# EAGLE schematic node_v2 (EAGLE 7.2.0)
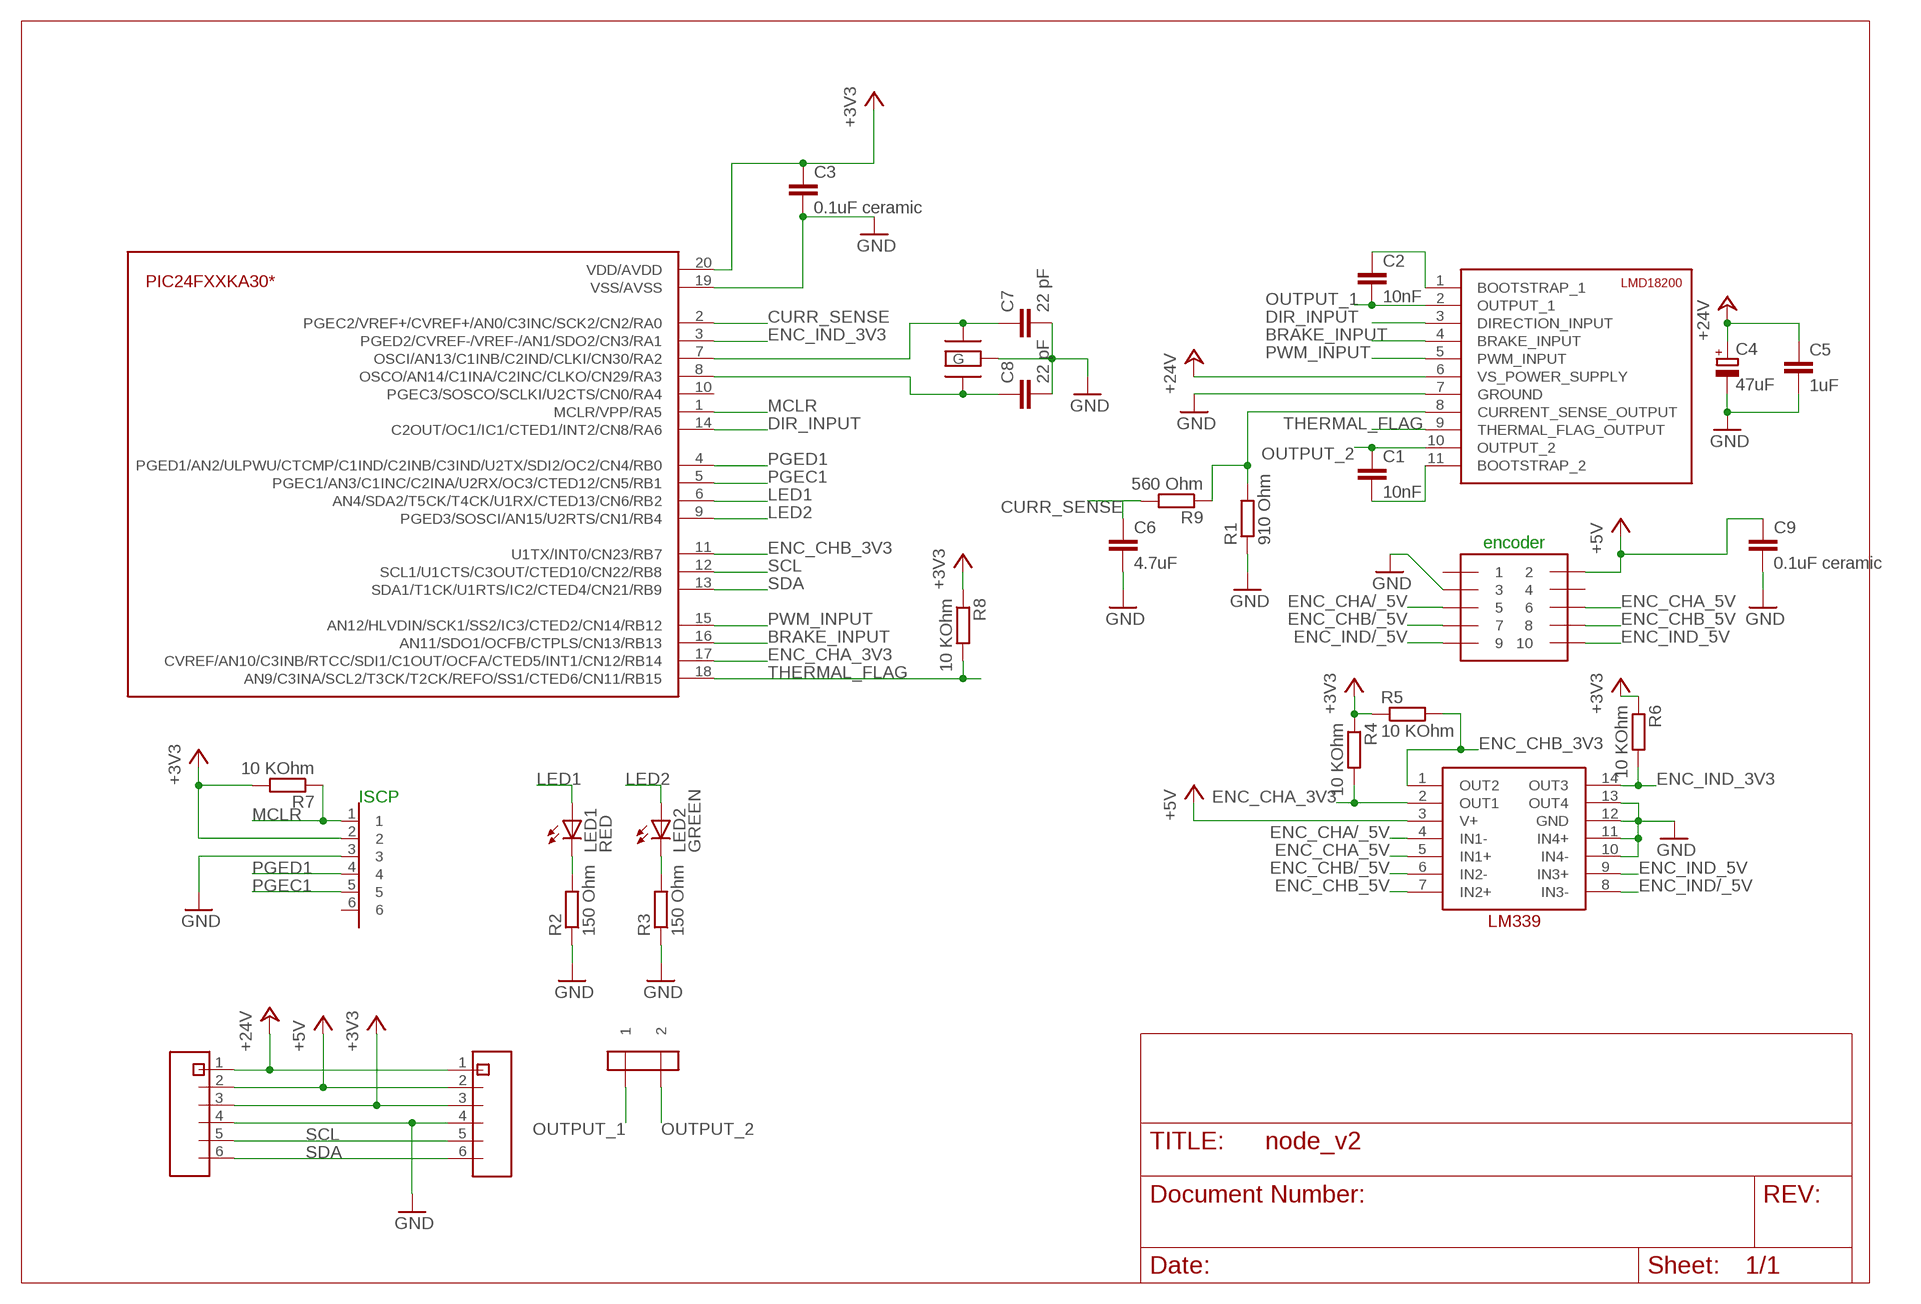
[diagram p0: schematic, sheet 1]

## Parts
C1  10nF  C-EUC0603  [C0603]
C2  10nF  C-EUC0603  [C0603]
C3  0.1uF ceramic  C-EUC0805K  [C0805K]
C4  47uF  CPOL-EUE5-10.5  [E5-10,5]
C5  1uF  C-EU050-025X075  [C050-025X075]
C6  4.7uF  C-EUC0805K  [C0805K]
C7  22 pF  C-EUC0603  [C0603]
C8  22 pF  C-EUC0603  [C0603]
C9  0.1uF ceramic  C-EUC0805K  [C0805K]
LED1  RED  LEDCHIPLED_1206  [CHIPLED_1206]
LED2  GREEN  LEDCHIPLED_1206  [CHIPLED_1206]
R1  910 Ohm  R-EU_R0603  [R0603]
R2  150 Ohm  R-EU_R0603  [R0603]
R3  150 Ohm  R-EU_R0603  [R0603]
R4  10 KOhm  R-EU_R0603  [R0603]
R5  10 KOhm  R-EU_R0603  [R0603]
R6  10 KOhm  R-EU_R0603  [R0603]
R7  10 KOhm  R-EU_R0603  [R0603]
R8  10 KOhm  R-EU_R0603  [R0603]
R9  560 Ohm  R-EU_R0603  [R0603]
U$1  PIC24F32KA301  [SSOP-20]
U$2  LMD18200  [TO-220-11]
U$3  MOLEX_3.96MM_6P  [MOLEX_3.96MM_6P]
U$4  MOLEX_3.96MM_6P  [MOLEX_3.96MM_6P]
U$5  DIN41651_10P  [DIN41651_10P]
U$6  STIFTLIST_6X1P  [STIFTLIST_6X1P]
U$7  CRYSTAL_ELFA  [CRYSTAL_SMD]
U$8  PCB_SKRUVPLINT_2P  [PCB_SKRUVPLINT_2P]
U$9  LM339  [SO14]

## Nets
+3V3: C3.1 R4.1 R5.1 R6.1 R7.2 R8.1 U$1.20(VDD/AVDD) U$3.3 U$4.3 U$6.2
+5V: C9.1 U$3.2 U$4.2 U$5.2 U$9.3(V+)
+24V: C4.+ C5.1 U$2.6(VS_POWER_SUPPLY) U$3.1 U$4.1
BRAKE_INPUT: U$1.16(AN11/SDO1/OCFB/CTPLS/CN13/RB13) U$2.4(BRAKE_INPUT)
CURR_SENSE: C6.1 R9.2 U$1.2(PGEC2/VREF+/CVREF+/AN0/C3INC/SCK2/CN2/RA0)
CURR_SENSE_OUTPUT: R1.2 R9.1 U$2.8(CURRENT_SENSE_OUTPUT)
DIR_INPUT: U$1.14(C2OUT/OC1/IC1/CTED1/INT2/CN8/RA6) U$2.3(DIRECTION_INPUT)
ENC_CHA/_5V: U$5.5 U$9.4(IN1-)
ENC_CHA_3V3: R4.2 U$1.17(CVREF/AN10/C3INB/RTCC/SDI1/C1OUT/OCFA/CTED5/INT1/CN12/RB14) U$9.2(OUT1)
ENC_CHA_5V: U$5.6 U$9.5(IN1+)
ENC_CHB/_5V: U$5.7 U$9.6(IN2-)
ENC_CHB_3V3: R5.2 U$1.11(U1TX/INT0/CN23/RB7) U$9.1(OUT2)
ENC_CHB_5V: U$5.8 U$9.7(IN2+)
ENC_IND/_5V: U$5.9 U$9.8(IN3-)
ENC_IND_3V3: R6.2 U$1.3(PGED2/CVREF-/VREF-/AN1/SDO2/CN3/RA1) U$9.14(OUT3)
ENC_IND_5V: U$5.10 U$9.9(IN3+)
GND: C3.2 C4.- C5.2 C6.2 C7.2 C8.2 C9.2 R1.1 R2.1 R3.1 U$1.19(VSS/AVSS) U$2.7(GROUND) U$3.4 U$4.4 U$5.3 U$6.3 U$7.2(G) U$7.4(G) U$9.10(IN4-) U$9.11(IN4+) U$9.12(GND) U$9.13(OUT4)
LED1: LED1.A U$1.6(AN4/SDA2/T5CK/T4CK/U1RX/CTED13/CN6/RB2)
LED2: LED2.A U$1.9(PGED3/SOSCI/AN15/U2RTS/CN1/RB4)
MCLR: R7.1 U$1.1(MCLR/VPP/RA5) U$6.1
N$1: C1.2 U$2.11(BOOTSTRAP_2)
N$2: LED1.C R2.2
N$3: LED2.C R3.2
N$4: C2.1 U$2.1(BOOTSTRAP_1)
N$5: C7.1 U$1.7(OSCI/AN13/C1INB/C2IND/CLKI/CN30/RA2) U$7.3(CRYSTAL_2)
N$6: C8.1 U$1.8(OSCO/AN14/C1INA/C2INC/CLKO/CN29/RA3) U$7.1(CRYSTAL_1)
OUTPUT_1: C2.2 U$2.2(OUTPUT_1) U$8.1
OUTPUT_2: C1.1 U$2.10(OUTPUT_2) U$8.2
PGEC1: U$1.5(PGEC1/AN3/C1INC/C2INA/U2RX/OC3/CTED12/CN5/RB1) U$6.5
PGED1: U$1.4(PGED1/AN2/ULPWU/CTCMP/C1IND/C2INB/C3IND/U2TX/SDI2/OC2/CN4/RB0) U$6.4
PWM_INPUT: U$1.15(AN12/HLVDIN/SCK1/SS2/IC3/CTED2/CN14/RB12) U$2.5(PWM_INPUT)
SCL: U$1.12(SCL1/U1CTS/C3OUT/CTED10/CN22/RB8) U$3.5 U$4.5
SDA: U$1.13(SDA1/T1CK/U1RTS/IC2/CTED4/CN21/RB9) U$3.6 U$4.6
THERMAL_FLAG: R8.2 U$1.18(AN9/C3INA/SCL2/T3CK/T2CK/REFO/SS1/CTED6/CN11/RB15) U$2.9(THERMAL_FLAG_OUTPUT)
Unconnected: U$1.10(PGEC3/SOSCO/SCLKI/U2CTS/CN0/RA4) U$5.1 U$5.4 U$6.6

## Notes on the sheet
- encoder
- ISCP

## Library data of the parts
C1-C3 C6 C9 = resistor:C-EU: CAPACITOR, European symbol
C4 = rcl:CPOL-EU: POLARIZED CAPACITOR, European symbol
C5 C7 C8 = rcl:C-EU: CAPACITOR, European symbol
LED1 LED2 = led:LED: LED OSRAM: - CHIPLED LG R971, LG N971, LY N971, LG Q971, LY Q971, LO R971, LY R971 LH N974, LH R974 LS Q976, LO Q976, LY Q976 LO Q996 - Hyper CHIPLED LW Q18S LB Q993, LB Q99A, LB R99A - SideLED LS A670, LO A670, LY A670, LG A670, LP A670 LB A673, LV A673, LT A673, LW A673 LH A674 LY A675 LS A676, LA A676, LO A676, LY A676, LW A676 LS A679, LY A679, LG A679 - Hyper Micro SIDELED® LS Y876, LA Y876, LO Y876, LY Y876 LT Y87S - SmartLED LW L88C, LW L88S LB L89C, LB L89S, LG L890 LS L89K, LO L89K, LY L89K LS L896, LA L896, LO L896, LY L896 - TOPLED LS T670, LO T670, LY T670, LG T670, LP T670 LSG T670, LSP T670, LSY T670, LOP T670, LYG T670 LG T671, LOG T671, LSG T671 LB T673, LV T673, LT T673, LW T673 LH T674 LS T676, LA T676, LO T676, LY T676, LB T676, LH T676, LSB T676, LW T676 LB T67C, LV T67C, LT T67C, LS T67K, LO T67K, LY T67K, LW E67C LS E67B, LA E67B, LO E67B, LY E67B, LB E67C, LV E67C, LT E67C LW T67C LS T679, LY T679, LG T679 LS T770, LO T770, LY T770, LG T770, LP T770 LB T773, LV T773, LT T773, LW T773 LH T774 LS E675, LA E675, LY E675, LS T675 LS T776, LA T776, LO T776, LY T776, LB T776 LHGB T686 LT T68C, LB T68C - Hyper Mini TOPLED® LB M676 - Mini TOPLED Santana® LG M470 LS M47K, LO M47K, LY M47K Source: http://www.osram.convergy.de LUXEON: - LUMILED® LXK2-PW12-R00, LXK2-PW12-S00, LXK2-PW14-U00, LXK2-PW14-V00 LXK2-PM12-R00, LXK2-PM12-S00, LXK2-PM14-U00 LXK2-PE12-Q00, LXK2-PE12-R00, LXK2-PE12-S00, LXK2-PE14-T00, LXK2-PE14-U00 LXK2-PB12-K00, LXK2-PB12-L00, LXK2-PB12-M00, LXK2-PB14-N00, LXK2-PB14-P00, LXK2-PB14-Q00 LXK2-PR12-L00, LXK2-PR12-M00, LXK2-PR14-Q00, LXK2-PR14-R00 LXK2-PD12-Q00, LXK2-PD12-R00, LXK2-PD12-S00 LXK2-PH12-R00, LXK2-PH12-S00 LXK2-PL12-P00, LXK2-PL12-Q00, LXK2-PL12-R00 Source: www.luxeon.com KINGBRIGHT: KA-3528ASYC Source: www.kingbright.com
R1-R9 = resistor:R-EU_: RESISTOR, European symbol
U$1 = mylib:PIC24F32KA301: PIC32F32KA30* available at https://www.elfa.se/elfa3~se_sv/elfa/init.do?item=73-349-31&toc=20970
U$2 = mylib:LMD18200: LMD18200 motor control chip with current sense 3A
U$3 U$4 = mylib:MOLEX_3.96MM_6P: A 6 pin molex connector with raster 3.96mm
U$5 = mylib:DIN41651_10P: DIN 41651 10P contact https://www.elfa.se/elfa3~se_sv/elfa/init.do?item=43-653-93&toc=0&q=DIN+41651+10P
U$6 = mylib:STIFTLIST_6X1P
U$7 = mylib:CRYSTAL_ELFA: Crystal: https://www.elfa.se/elfa3~se_sv/elfa/init.do?item=74-519-88&toc=20166
U$8 = mylib:PCB_SKRUVPLINT_2P
U$9 = mylib:LM339: LM339 voltage comparator with open collector outputs